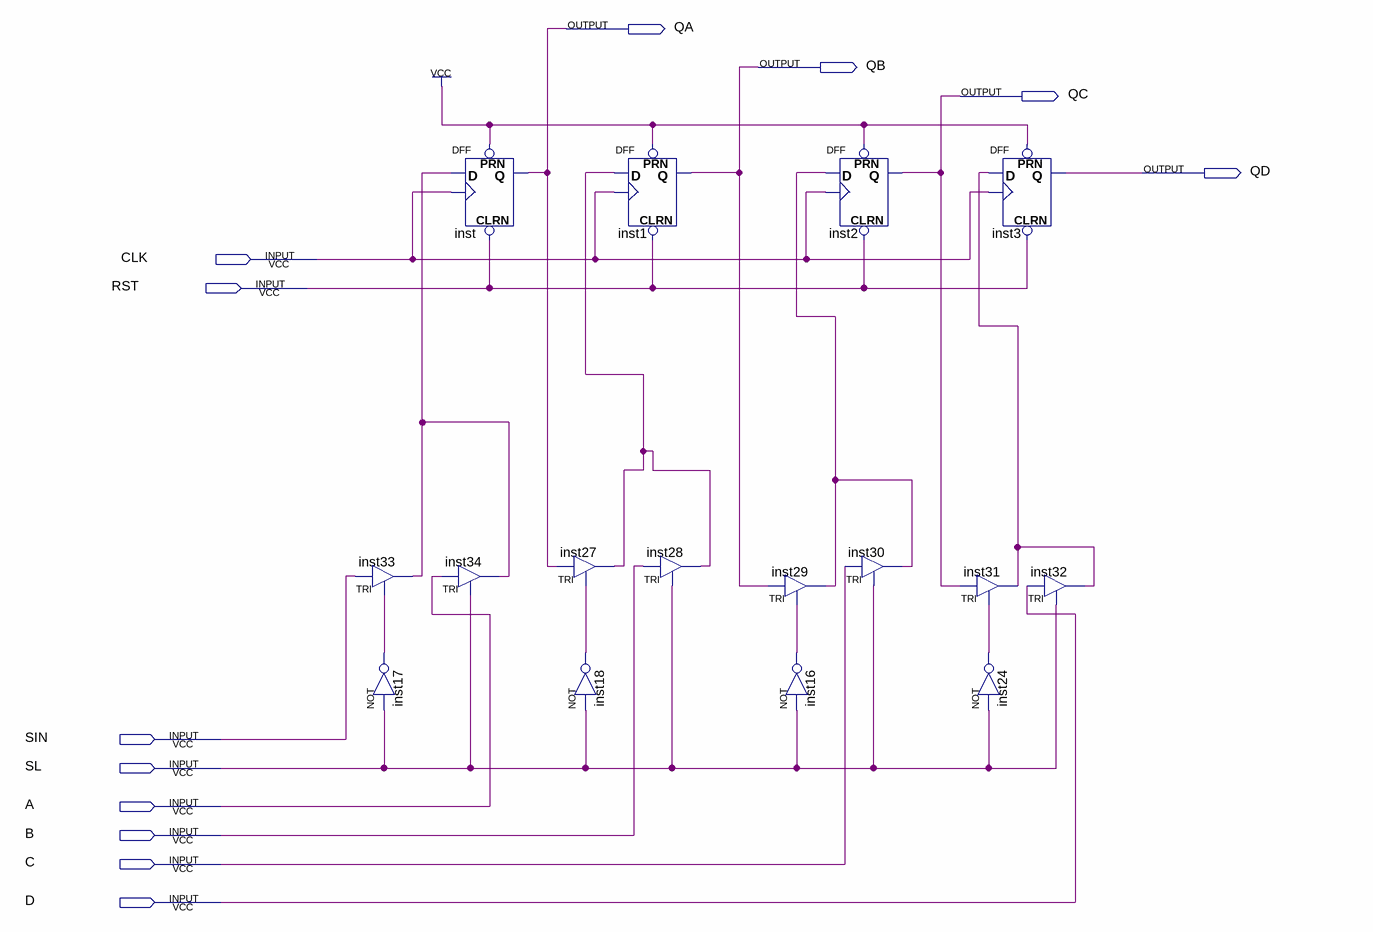
[diagram p0: schematic sheet]
// Quartus schematic Exercise8.bdf as structural Verilog: 16 symbols, 12 pins
module Exercise8 (
  input  CLK,
  input  RST,
  input  SIN,
  input  SL,
  input  A,
  input  B,
  input  C,
  input  D,
  output QA,
  output QB,
  output QC,
  output QD
);

  wire inst16_out, inst17_out, inst18_out, inst24_out, inst27_out, inst29_out, inst31_out, inst33_out;

  TRI inst33 (.IN(SIN), .OE(inst17_out), .OUT(inst33_out));
  not inst17 (inst17_out, SL);
  DFF inst (.CLRN(RST), .CLK(CLK), .D(inst33_out), .PRN(1'b1), .Q(QA));
  TRI inst34 (.IN(A), .OE(SL), .OUT(inst33_out));
  TRI inst27 (.IN(QA), .OE(inst18_out), .OUT(inst27_out));
  not inst18 (inst18_out, SL);
  DFF inst1 (.CLRN(RST), .CLK(CLK), .D(inst27_out), .PRN(1'b1), .Q(QB));
  TRI inst28 (.IN(B), .OE(SL), .OUT(inst27_out));
  TRI inst29 (.IN(QB), .OE(inst16_out), .OUT(inst29_out));
  not inst16 (inst16_out, SL);
  DFF inst2 (.CLRN(RST), .CLK(CLK), .D(inst29_out), .PRN(1'b1), .Q(QC));
  TRI inst30 (.IN(C), .OE(SL), .OUT(inst29_out));
  DFF inst3 (.CLRN(RST), .CLK(CLK), .D(inst31_out), .PRN(1'b1), .Q(QD));
  TRI inst31 (.IN(QC), .OE(inst24_out), .OUT(inst31_out));
  TRI inst32 (.IN(D), .OE(SL), .OUT(inst31_out));
  not inst24 (inst24_out, SL);
endmodule
